# EasyEDA Pro project ProPrj_USB HUB!!!_2026-05-06.epro

# Schematic Schematic1
Board Name: Board1; Create Date: 2026-04-30; Page Name: P1; Project Name: USB HUB!!!; Schematic Name: Schematic1; Update Date: 2026-04-30; Company: EasyEDA.com; Page Size: A4; Version: V1.0
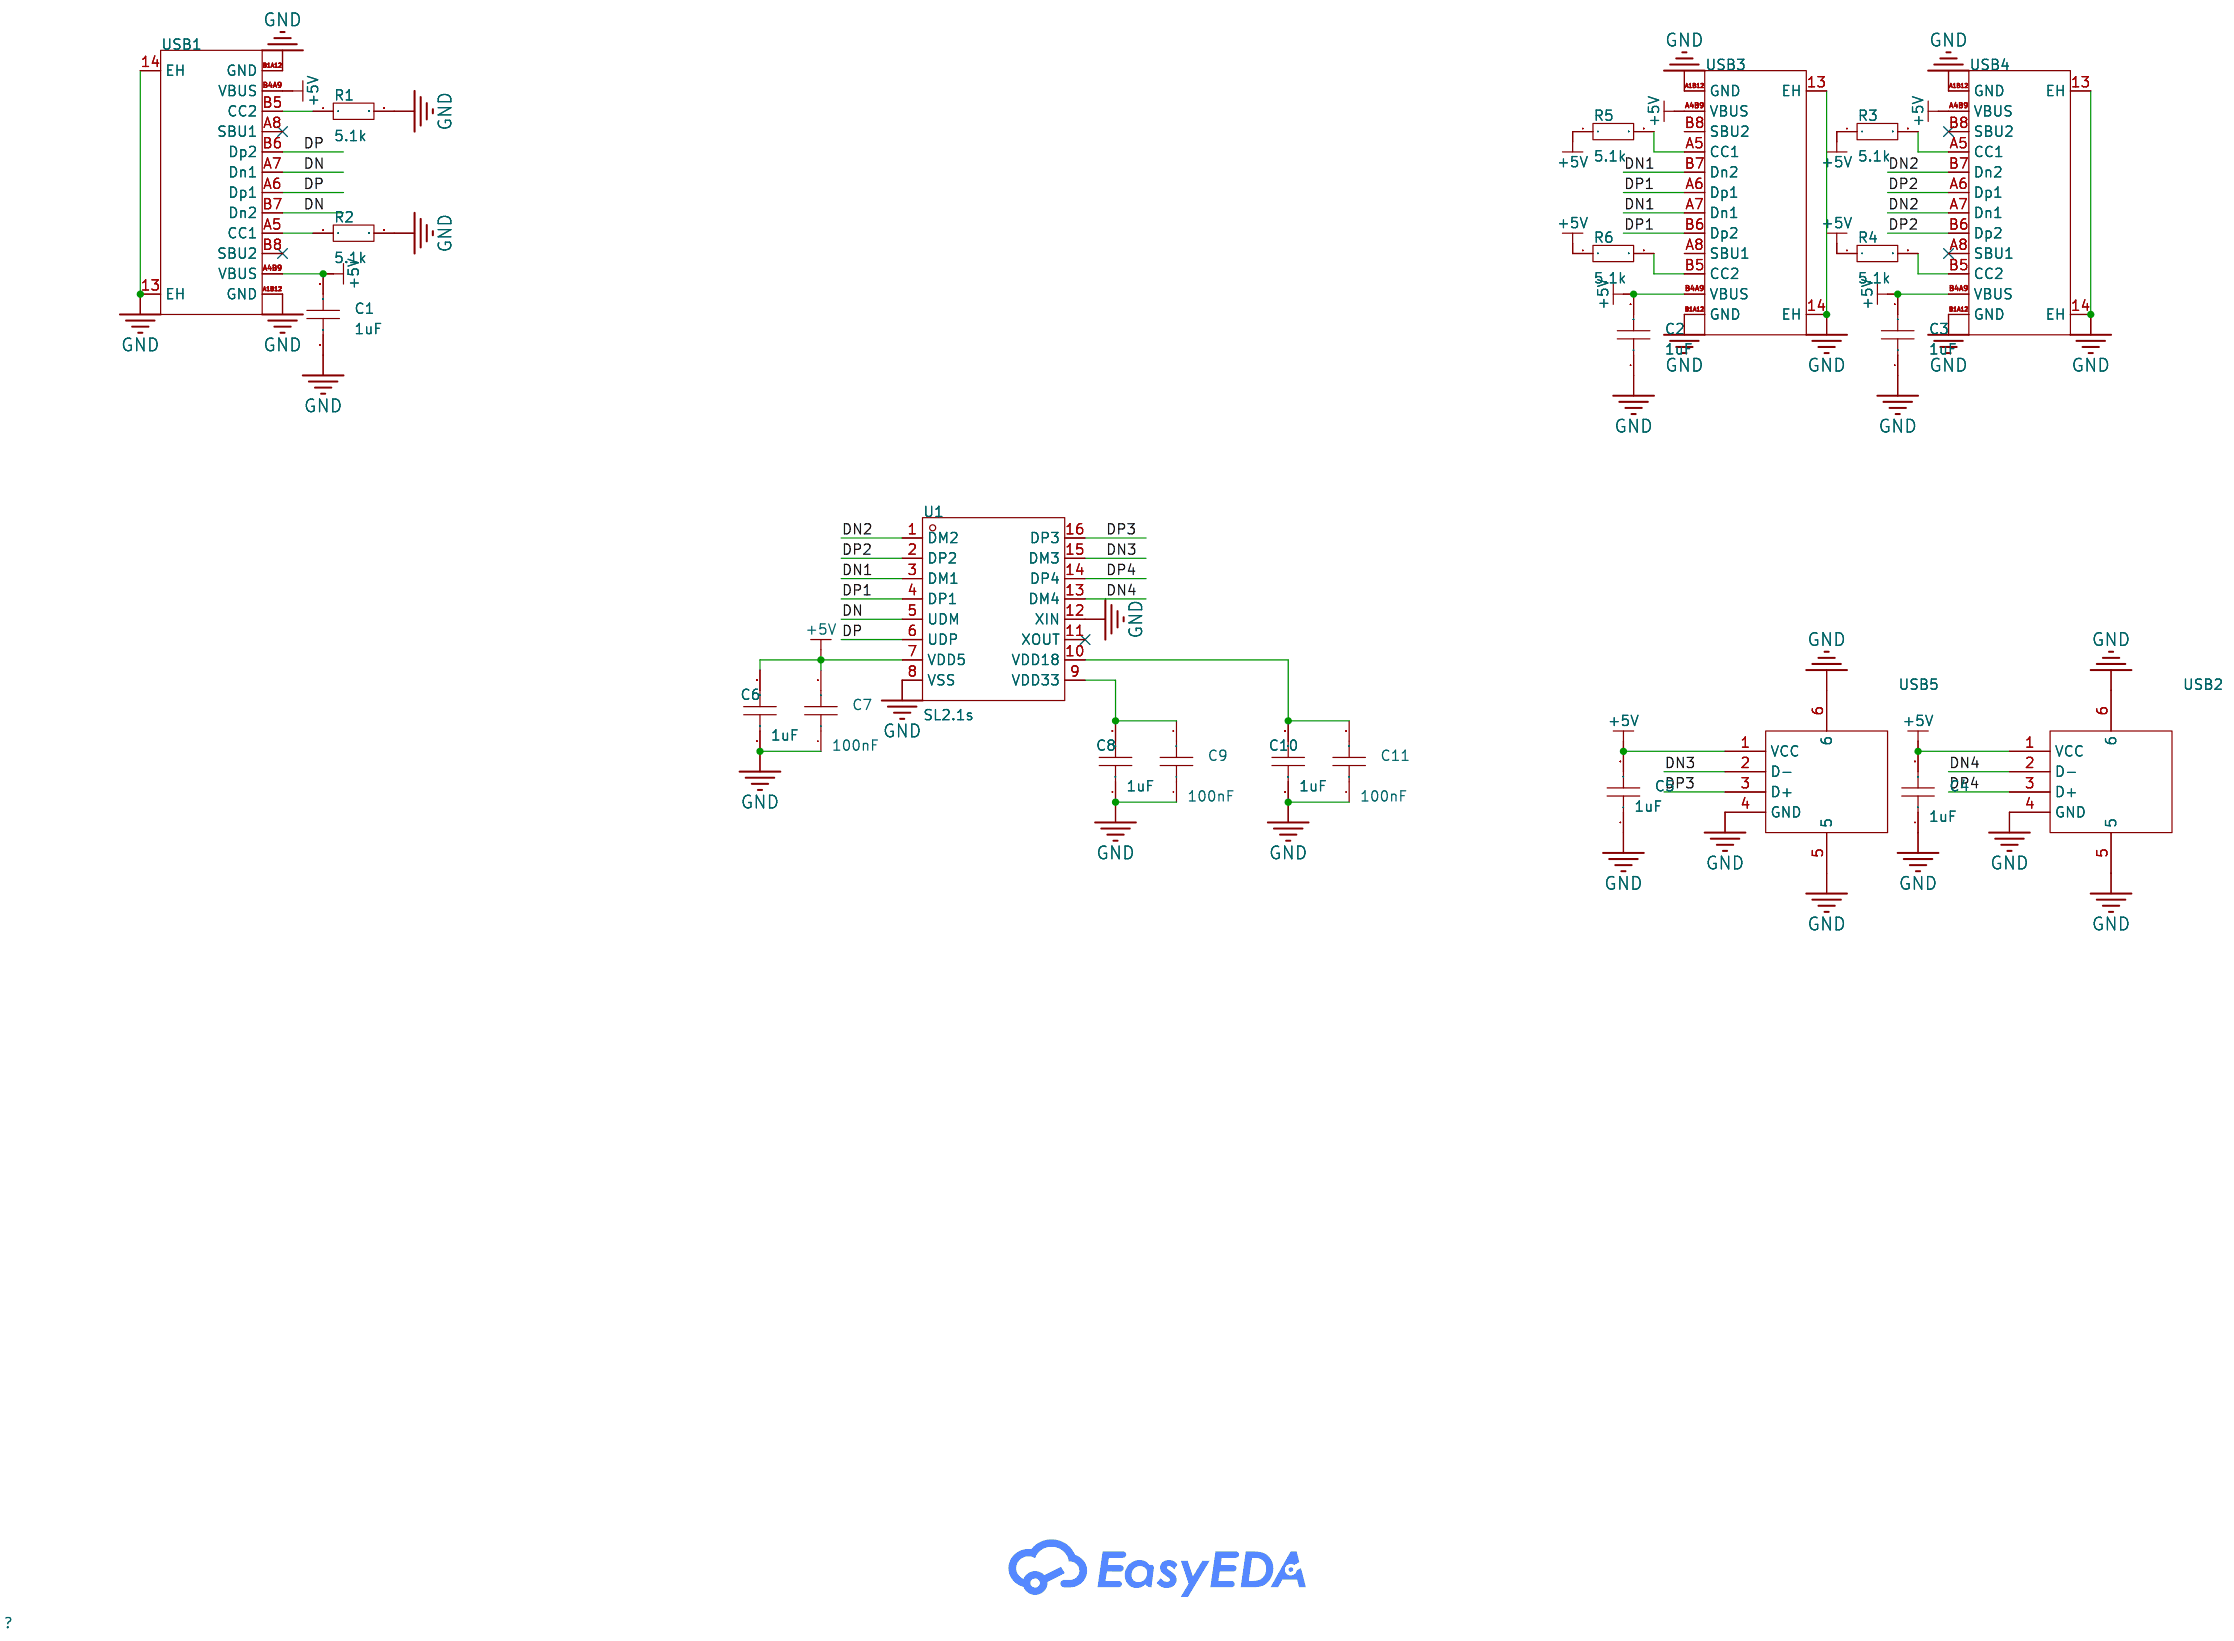
[diagram p0: schematic sheet]

## Parts
C1  1uF  [C0603]
C2  1uF  [C0603]
C3  1uF  [C0603]
C4  1uF  [C0603]
C5  1uF  [C0603]
C6  1uF  [C0603]
C7  100nF  [C0603]
C8  1uF  [C0603]
C9  100nF  [C0603]
C10  1uF  [C0603]
C11  100nF  [C0603]
R1  5.1k  [R0603]
R2  5.1k  [R0603]
R3  5.1k  [R0603]
R4  5.1k  [R0603]
R5  5.1k  [R0603]
R6  5.1k  [R0603]
U1  SL2.1s  [SSOP-16_L4.6-W2.6-P0.53-LS4.0-BL]
USB1  TYPE-C 16PIN 2MD(073)  [USB-C-SMD_TYPE-C-16PIN-2MD-073]
USB2  10.0 QHHTZB6.3  [USB-A-TH_10.0QHHTZB6.3]
USB3  TYPE-C 16PIN 2MD(073)  [USB-C-SMD_TYPE-C-16PIN-2MD-073]
USB4  TYPE-C 16PIN 2MD(073)  [USB-C-SMD_TYPE-C-16PIN-2MD-073]
USB5  10.0 QHHTZB6.3  [USB-A-TH_10.0QHHTZB6.3]

## Library data of the parts
C1-C11 = CAP_0603: Supplier Footprint: 0603
R1-R6 = Res_0603: Supplier Footprint: 0603
U1 = SL2.1s: type:Hub USB Protocol:USB 2.0 Data Rate:- Voltage - Supply:4V~5.25V Voltage - Supply:4V~5.25V Operating Temperature:0℃~+70℃ Operating Temperature:0℃~+70℃ Memory Interface:- Current - Supply:120mA Quiescent Supply Current:2.5mA Number of Channels:4; LCSC Part Name: USB2.0 HUB控制器集成电路; Supplier Part: C2684433; Manufacturer: CoreChips(和芯润德); Supplier Footprint: SSOP-16; JLCPCB Part Class: Extended Part; Datasheet: https://item.szlcsc.com/datasheet/SL2.1s/2782346.html; Supplier: LCSC; type: Hub; USB Protocol: USB 2.0; Voltage - Supply: 4V~5.25V; Operating Temperature: 0℃~+70℃; Current - Supply: 120mA; Quiescent Supply Current: 2.5mA; Number of Channels: 4
USB1 USB3 USB4 = TYPE-C 16PIN 2MD(073): Connector Type:Type-C Protocol Standard:- Gender:Female Mounting Type:Surface Mount, Right Angle Number of Contacts:16P Number of Ports:1 Current Rating-Power:3A Voltage Rating:5V Connect-Disconnect Life:10,000 Cycles Supplementary Features:- Center Heigh; LCSC Part Name: Type-C 母 卧贴; Supplier Part: C2765186; Manufacturer: SHOU HAN(首韩); Supplier Footprint: SMD; JLCPCB Part Class: Extended Part; Datasheet: https://item.szlcsc.com/datasheet/TYPE-C%252016PIN%25202MD(073)/2901843.html; Supplier: LCSC; Connector Type: Type-C; Gender: Female; Mounting Type: Surface Mount, Right Angle; Number of Contacts: 16P; Number of Ports: 1; Current Rating-Power: 3A; Voltage Rating: 5V; Connect-Disconnect Life: 10,000 Cycles; Detection color: Black; Operating Temperature: -25℃~+85℃
USB2 USB5 = 10.0 QHHTZB6.3: Connector Type:Type-A Protocol Standard:USB 2.0 Gender:Female Mounting Type:Surface Mount, Right Angle Number of Contacts:4P Number of Ports:1 Current Rating-Power:1.5A Voltage Rating:30V Connect-Disconnect Life:5,000 times Supplementary Features:- Center; LCSC Part Name: 壳长10.0mm; Supplier Part: C668591; Manufacturer: SHOU HAN(首韩); Supplier Footprint: SMD; JLCPCB Part Class: Extended Part; Datasheet: https://item.szlcsc.com/datasheet/10.0%2520QHHTZB6.3/698534.html; Supplier: LCSC; Connector Type: Type-A; Protocol Standard: USB 2.0; Gender: Female; Mounting Type: Surface Mount, Right Angle; Number of Contacts: 4P; Number of Ports: 1; Current Rating-Power: 1.5A; Voltage Rating: 30V; Connect-Disconnect Life: 5,000 times; Length: 10mm; Detection color: Black; Operating Temperature: -25℃~+85℃

## Nets
+5V: C1.2 C2.2 C3.2 C4.2 C5.2 C6.2 C7.2 R3.1 R4.1 R5.1 R6.1 U1.7(VDD5) USB1.A4B9(VBUS) USB1.B4A9(VBUS) USB2.1(VCC) USB3.A4B9(VBUS) USB3.B4A9(VBUS) USB4.A4B9(VBUS) USB4.B4A9(VBUS) USB5.1(VCC)
GND: C1.1 C2.1 C3.1 C4.1 C5.1 C6.1 C7.1 C8.1 C9.1 C10.1 C11.1 R1.2 R2.2 U1.8(VSS) U1.12(XIN) USB1.13(EH) USB1.14(EH) USB1.A1B12(GND) USB1.B1A12(GND) USB2.4(GND) USB2.5 USB2.6 USB3.13(EH) USB3.14(EH) USB3.A1B12(GND) USB3.B1A12(GND) USB4.13(EH) USB4.14(EH) USB4.A1B12(GND) USB4.B1A12(GND) USB5.4(GND) USB5.5 USB5.6
DN: U1.5(UDM) USB1.A7(Dn1) USB1.B7(Dn2)
DN1: U1.3(DM1) USB3.A7(Dn1) USB3.B7(Dn2)
DN2: U1.1(DM2) USB4.A7(Dn1) USB4.B7(Dn2)
DN3: U1.15(DM3) USB5.2(D-)
DN4: U1.13(DM4) USB2.2(D-)
DP: U1.6(UDP) USB1.A6(Dp1) USB1.B6(Dp2)
DP1: U1.4(DP1) USB3.A6(Dp1) USB3.B6(Dp2)
DP2: U1.2(DP2) USB4.A6(Dp1) USB4.B6(Dp2)
DP3: U1.16(DP3) USB5.3(D+)
DP4: U1.14(DP4) USB2.3(D+)
$1N1217: R1.1 USB1.B5(CC2)
$1N1221: R2.1 USB1.A5(CC1)
$1N1867: R3.2 USB4.A5(CC1)
$1N1893: R4.2 USB4.B5(CC2)
$1N2023: R5.2 USB3.A5(CC1)
$1N2026: R6.2 USB3.B5(CC2)
$1N2635: C8.2 C9.2 U1.9(VDD33)
$1N2647: C10.2 C11.2 U1.10(VDD18)

Not connected (* = marked no-connect by the designer): U1 11(XOUT)*; USB1 A8(SBU1)* B8(SBU2)*; USB3 A8(SBU1) B8(SBU2); USB4 A8(SBU1)* B8(SBU2)*

# Board PCB1
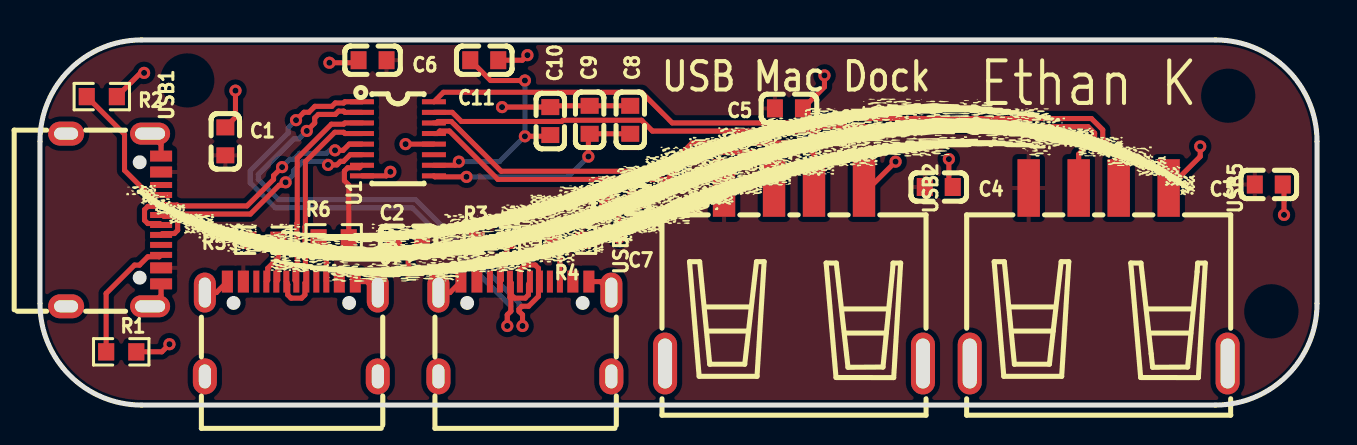
[diagram p1: board, top side]
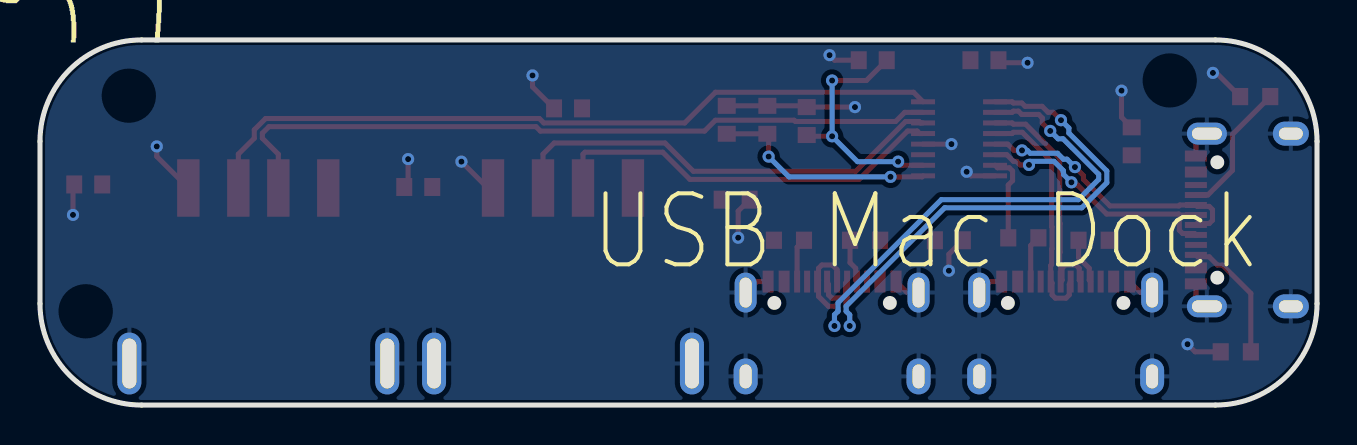
[diagram p2: board, bottom side, seen from below]

Outline 63.88 x 18.29 mm; copper layers: Top Layer, Bottom Layer. Coordinates in mm from the lower left corner of the outline.
Outline path: 0,13.21 0,5.08 arc(1.49,1.49) 5.08,0 58.8,0 arc(62.39,1.49) 63.88,5.08 63.88,13.21 arc(62.39,16.8) 58.8,18.29 5.08,18.29 arc(1.49,16.8) 0,13.21
Stack: Top Layer 0.035mm / Dielectric1 1.51mm FR4 er 4.5 / Bottom Layer 0.035mm

## Design rules (mm)
net DN2: DP3
net DP2: DP3
net DN1: DP2
net DP1: DP2
net DN: DP1
net DP: DP1
net DN4: DP5
net DP4: DP5
net DN3: DP4
net DP3: DP4
template: Custom Config
spacing copperThickness1oz (default): track to track 0.102, other pairs 0.152 to 0.3
spacing copperThickness2oz: track to track 0.203, other pairs 0.152 to 0.3
track width copperThickness1oz (default): min 0.127, default 0.254, max 2.54
track width copperThickness2oz: min 0.203, default 0.254, max 2.54
differential pair differentialPair (default): width min 0.127, default 0.254, max 2.54; gap min 0.152, default 0.152
via viaSize (default): diameter min 0.5, default 0.61, max 10; hole min 0.3, default 0.305, max 6.3

## Placement (name value [footprint] x y rotation side)
C1  1uF  [C0603]  9.27 13.21 270 top
C2  1uF  [C0603]  18.41 8.25 0 top
C3  1uF  [C0603]  61.47 11.05 180 top
C4  1uF  [C0603]  44.96 10.92 180 top
C5  1uF  [C0603]  37.47 14.86 180 top
C6  1uF  [C0603]  16.64 17.27 0 top
C7  100nF  [C0603]  29.08 10.29 0 top
C8  1uF  [C0603]  29.53 14.29 270 top
C9  100nF  [C0603]  27.5 14.29 270 top
C10  1uF  [C0603]  25.53 14.22 270 top
C11  100nF  [C0603]  22.22 17.27 180 top
R1  5.1k  [R0603]  4.06 2.67 0 top
R2  5.1k  [R0603]  3.09 15.45 0 top
R3  5.1k  [R0603]  22.61 8.25 0 top
R4  5.1k  [R0603]  26.42 8.25 180 top
R5  5.1k  [R0603]  11.18 8.25 0 top
R6  5.1k  [R0603]  14.69 8.38 180 top
U1  SL2.1s  [SSOP-16_L4.6-W2.6-P0.53-LS4.0-BL]  17.91 13.33 270 top
USB1  TYPE-C 16PIN 2MD(073)  [USB-C-SMD_TYPE-C-16PIN-2MD-073]  3.68 9.27 270 top
USB2  10.0 QHHTZB6.3  [USB-A-TH_10.0QHHTZB6.3]  37.72 6.48 0 top
USB3  TYPE-C 16PIN 2MD(073)  [USB-C-SMD_TYPE-C-16PIN-2MD-073]  12.57 3.81 0 top
USB4  TYPE-C 16PIN 2MD(073)  [USB-C-SMD_TYPE-C-16PIN-2MD-073]  24.26 3.81 0 top
USB5  10.0 QHHTZB6.3  [USB-A-TH_10.0QHHTZB6.3]  52.96 6.48 0 top

## Footprints (pads in the part's own frame, mm; a bottom-side part is the same pattern mirrored in y, then rotated)
C0603
  rect 0.8x0.9 smd: 1(-0.7,0) 2(0.7,0)
R0603
  rect 0.806x0.864 smd: 1(-0.753,0) 2(0.753,0)
SSOP-16_L4.6-W2.6-P0.53-LS4.0-BL
  rect 0.25x1.2 smd: 1(-1.855,-1.8) 2(-1.325,-1.8) 3(-0.795,-1.8) 4(-0.265,-1.8) 5(0.265,-1.8) 6(0.795,-1.8) 7(1.325,-1.8) 8(1.855,-1.8) 9(1.855,1.8) 10(1.325,1.8) 11(0.795,1.8) 12(0.265,1.8) 13(-0.265,1.8) 14(-0.795,1.8) 15(-1.325,1.8) 16(-1.855,1.8)
USB-A-TH_10.0QHHTZB6.3
  rect 1.12x2.88 smd: 1(-3.5,4.395) 2(-1,4.395) 3(1,4.395) 4(3.5,4.395)
  oval 1.2x3.1 hole 0.7x2.5: 5(-6.45,-4.395) 6(6.45,-4.395)
USB-C-SMD_TYPE-C-16PIN-2MD-073
  oval 1.1x2 hole 0.6x1.5: 13(-4.325,1.825) 14(4.325,1.825)
  oval 1.2x1.8 hole 0.6x1.2: 13(-4.325,-2.375) 14(4.325,-2.375)
  rect 0.55x1.1 smd: A1B12(-3.2,2.375) A4B9(-2.4,2.375) B1A12(3.2,2.375) B4A9(2.4,2.375)
  rect 0.3x1.1 smd: A5(-1.25,2.375) A6(-0.25,2.375) A7(0.25,2.375) A8(1.25,2.375) B5(1.75,2.375) B6(0.75,2.375) B7(-0.75,2.375) B8(-1.75,2.375)

## Nets
As in the schematic.

Pads without a net: U1 11; USB1 A8 B8; USB3 A8 B8; USB4 A8 B8

## Via types
v1: diameter 0.61, hole 0.305, Top Layer to Bottom Layer, 28 vias

## Routing (per net, layer and track width the routed paths; a pad name or vN(x,y) marks a point on that pad's centre or on a via; arc(x,y) is an arc through that point)
+5V: length 4.4
  Top Layer w0.254: U1.7 15.98,11.88 15.39,11.88 15.23,11.72 15.23,11.24 15.44,11.02 R6.1
GND: length 40.2
  Top Layer w0.254: C6.1 15.81,17.14 v1(14.48,17.14) ; v1(9.78,15.75) 9.78,14.42 C1.1 ; USB4.14 28.03,6.19 USB4.B1A12 ; USB1.14 6.06,5.5 USB1.B1A12 ; R1.2 6.1,2.67 v1(6.48,3.05) ; C7.1 28.96,9.71 v1(28.96,8.38) ; 5.51,13.6 6.06,13.05 USB1.A1B12 ; v1(23.11,14.92) C10.1 25.59,14.99 C9.1 C8.1 ; C4.1 45.47,11.11 v1(45.47,12.32) ; C3.1 62.23,10.99 v1(62.23,9.52) ; v1(39.24,16.51) 39.24,15.94 C5.1 ; v1(18.41,6.73) 18.41,7.55 C2.1 ; U1.12 v1(18.29,13.07) ; USB2.4 41.48,10.87 v1(42.8,12.19) ; R2.2 5.03,16.64 v1(5.21,16.64) ; USB5.4 58.04,12.45 v1(58.04,12.95) ; U1.8 17.32,11.48 v1(17.53,11.68) ; v1(24.38,17.53) 24.13,17.27 C11.1 ; USB3.13 8.82,5.63 9.37,6.19 ; USB3.14 16.35,6.19 USB3.B1A12 ; USB4.13 20.51,5.63 21.06,6.19
DN: length 13.8
  Top Layer w0.254: v1(14.76,12.76) 15.16,12.76 15.47,13.07 U1.5 ; v1(12.11,11.92) 11.68,11.49 11.68,11.3 10.35,9.97 6.91,9.97 6.86,10.02 USB1.B7 5.99,9.95 5.39,9.95 5.23,9.79 5.23,9.26 5.39,9.09 5.99,9.09 USB1.A7
  Bottom Layer w0.254: v1(12.11,11.92) 12.5,12.31 12.69,12.31 12.99,12.61 14.35,12.61 14.5,12.76 v1(14.76,12.76)
DN1: length 12.6
  Top Layer w0.254: U1.3 15.25,14.13 15.19,14.07 14.58,14.07 12.87,12.36 12.87,9.11 12.85,9.09 12.85,7.66 12.87,7.64 12.87,7.04 12.82,6.99 USB3.A7 12.75,6.26 12.75,6.85 12.59,7.01 12.06,7.01 11.89,6.85 11.89,6.26 USB3.B7
DN2: length 29.1
  Top Layer w0.254: USB4.A7 24.48,6.16 24.48,6.09 24.44,6.04 24.44,5.52 24.27,5.36 23.74,5.36 23.58,5.52 23.58,6.11 USB4.B7 23.51,5.38 23.55,5.33 23.55,4.7 23.38,4.52 v1(23.38,3.96) ; v1(12.81,14.27) 13.2,14.66 13.45,14.66 13.75,14.96 14.6,14.96 14.77,15.13 15.19,15.13 15.25,15.19 U1.1
  Bottom Layer w0.254: v1(12.81,14.27) 12.41,13.87 12.41,13.62 10.52,11.73 10.52,11.13 11.77,9.88 18.63,9.88 23.55,4.95 23.55,4.7 23.38,4.52 v1(23.38,3.96)
DN3: length 36.8
  Top Layer w0.254: U1.15 20.62,14.66 21.08,14.2 26.09,14.2 26.16,14.27 30.09,14.27 30.64,13.72 38.85,13.72 39.07,13.94 52.43,13.94 52.76,13.62 52.76,13.36 51.96,12.57 USB5.2
DN4: length 20.4
  Top Layer w0.254: U1.13 19.88,13.6 20,13.73 20.48,13.73 22.9,11.3 31.37,11.3 32.73,12.67 36.62,12.67 36.72,12.57 USB2.2
DP: length 14
  Top Layer w0.254: v1(12.29,11.16) 12.14,11.02 11.97,11.02 10.52,9.57 6.91,9.57 6.86,9.52 USB1.A6 6.08,9.5 6.16,9.5 6.2,9.45 6.72,9.45 6.89,9.29 6.89,8.76 6.72,8.59 6.13,8.59 USB1.B6 ; U1.6 15.52,12.54 15.18,12.21 15.03,12.21 14.86,12.03 v1(14.41,12.03)
  Bottom Layer w0.254: v1(14.41,12.03) 14.41,12.15 14.35,12.21 13.15,12.21 12.69,11.75 12.69,11.68 12.68,11.66 12.68,11.55 v1(12.29,11.16)
DP1: length 11.9
  Top Layer w0.254: USB3.A6 12.35,6.16 12.35,6.09 12.39,6.04 12.39,5.52 12.56,5.36 13.09,5.36 13.25,5.52 13.25,6.11 USB3.B6 13.32,6.99 13.28,7.04 13.28,7.81 13.26,7.83 13.26,8.92 13.28,8.94 13.28,12.19 14.75,13.66 15.19,13.66 15.25,13.6 U1.4
DP2: length 29.1
  Top Layer w0.254: v1(13.35,13.73) 13.74,14.13 13.74,14.38 13.92,14.56 14.77,14.56 14.94,14.72 15.19,14.72 15.25,14.66 U1.2 ; 24.94,6.26 24.94,6.85 24.77,7.01 24.24,7.01 24.01,6.78 USB4.A6 ; 24.94,6.26 24.94,5.44 24.44,4.95 24.1,4.95 23.96,4.81 23.96,4.7 24.14,4.52 v1(24.14,3.96) ; 24.94,6.26 USB4.B6
  Bottom Layer w0.254: v1(13.35,13.73) 12.95,13.33 12.7,13.33 10.92,11.56 10.92,11.3 11.94,10.29 18.79,10.29 23.96,5.12 23.96,4.7 24.14,4.52 v1(24.14,3.96)
DP3: length 37.9
  Top Layer w0.254: U1.16 20.18,15.67 30.09,15.67 31.63,14.13 38.68,14.13 38.9,14.35 52.6,14.35 53.16,13.78 53.16,13.36 53.96,12.57 USB5.3
DP4: length 22.6
  Top Layer w0.254: USB2.3 38.72,12.57 38.16,13.13 32.62,13.13 31.2,11.71 23.07,11.71 20.58,14.2 19.9,14.2 19.83,14.13 U1.14
$1N1217: length 6.5
  Top Layer w0.254: R1.1 3.31,5.59 4.73,7.01 4.98,7.01 5.39,7.42 5.96,7.42 USB1.B5
$1N1221: length 6.8
  Top Layer w0.254: R2.1 4.23,13.56 4.23,11.76 5.46,10.52 USB1.A5
$1N1867: length 2.2
  Top Layer w0.254: USB4.A5 23.08,6.26 23.08,6.85 23.36,7.13 R3.2
$1N1893: length 2.2
  Top Layer w0.254: R4.2 26.01,7.91 USB4.B5
$1N2023: length 2.3
  Top Layer w0.254: USB3.A5 11.39,6.26 11.39,6.85 11.93,7.39 R5.2
$1N2026: length 2.4
  Top Layer w0.254: USB3.B5 14.32,7.99 R6.2
$1N2635: length 11.4
  Top Layer w0.254: C8.2 C9.2 27.43,13.52 v1(27.43,12.45) ; U1.9 19.76,11.43 v1(21.34,11.43)
  Bottom Layer w0.254: v1(21.34,11.43) 26.42,11.43 v1(27.43,12.45)
$1N2647: length 12.4
  Top Layer w0.254: v1(20.96,12.19) 20.77,12.01 U1.10 ; v1(24.26,13.46) 25.47,13.46 C10.2 ; C11.2 22.54,16.26 v1(24.26,16.26)
  Bottom Layer w0.254: v1(24.26,16.26) v1(24.26,13.46) 22.99,12.19 v1(20.96,12.19)

## Copper pours and planes (outline as drawn; the poured copper is in the pictures)
+5V on Top Layer: -4.7,21.46 71.12,21.46 71.12,-3.05 -4.7,-3.05
GND on Bottom Layer: -4.95,21.46 66.42,21.46 66.42,-2.67 -4.95,-2.67

## Text on the board
Bottom Silkscreen Layer: USB Mac Dock
Top Silkscreen Layer: USB Mac Dock | Ethan K
